# Altium schematic sheet RX_USBC.SchDoc
size 431 x 279 mm; Organization: ORGANIZATION; Address1: ADDRESS 1; Address2: ADDRESS 2; Address3: ADDRESS 3; Address4: ADDRESS 4; Revision: -; SheetNumber: 1; SheetTotal: 7; ENG_APP_DATE: --/--/--; DSN_APP_DATE: --/--/--; CHK_APP_DATE: --/--/--
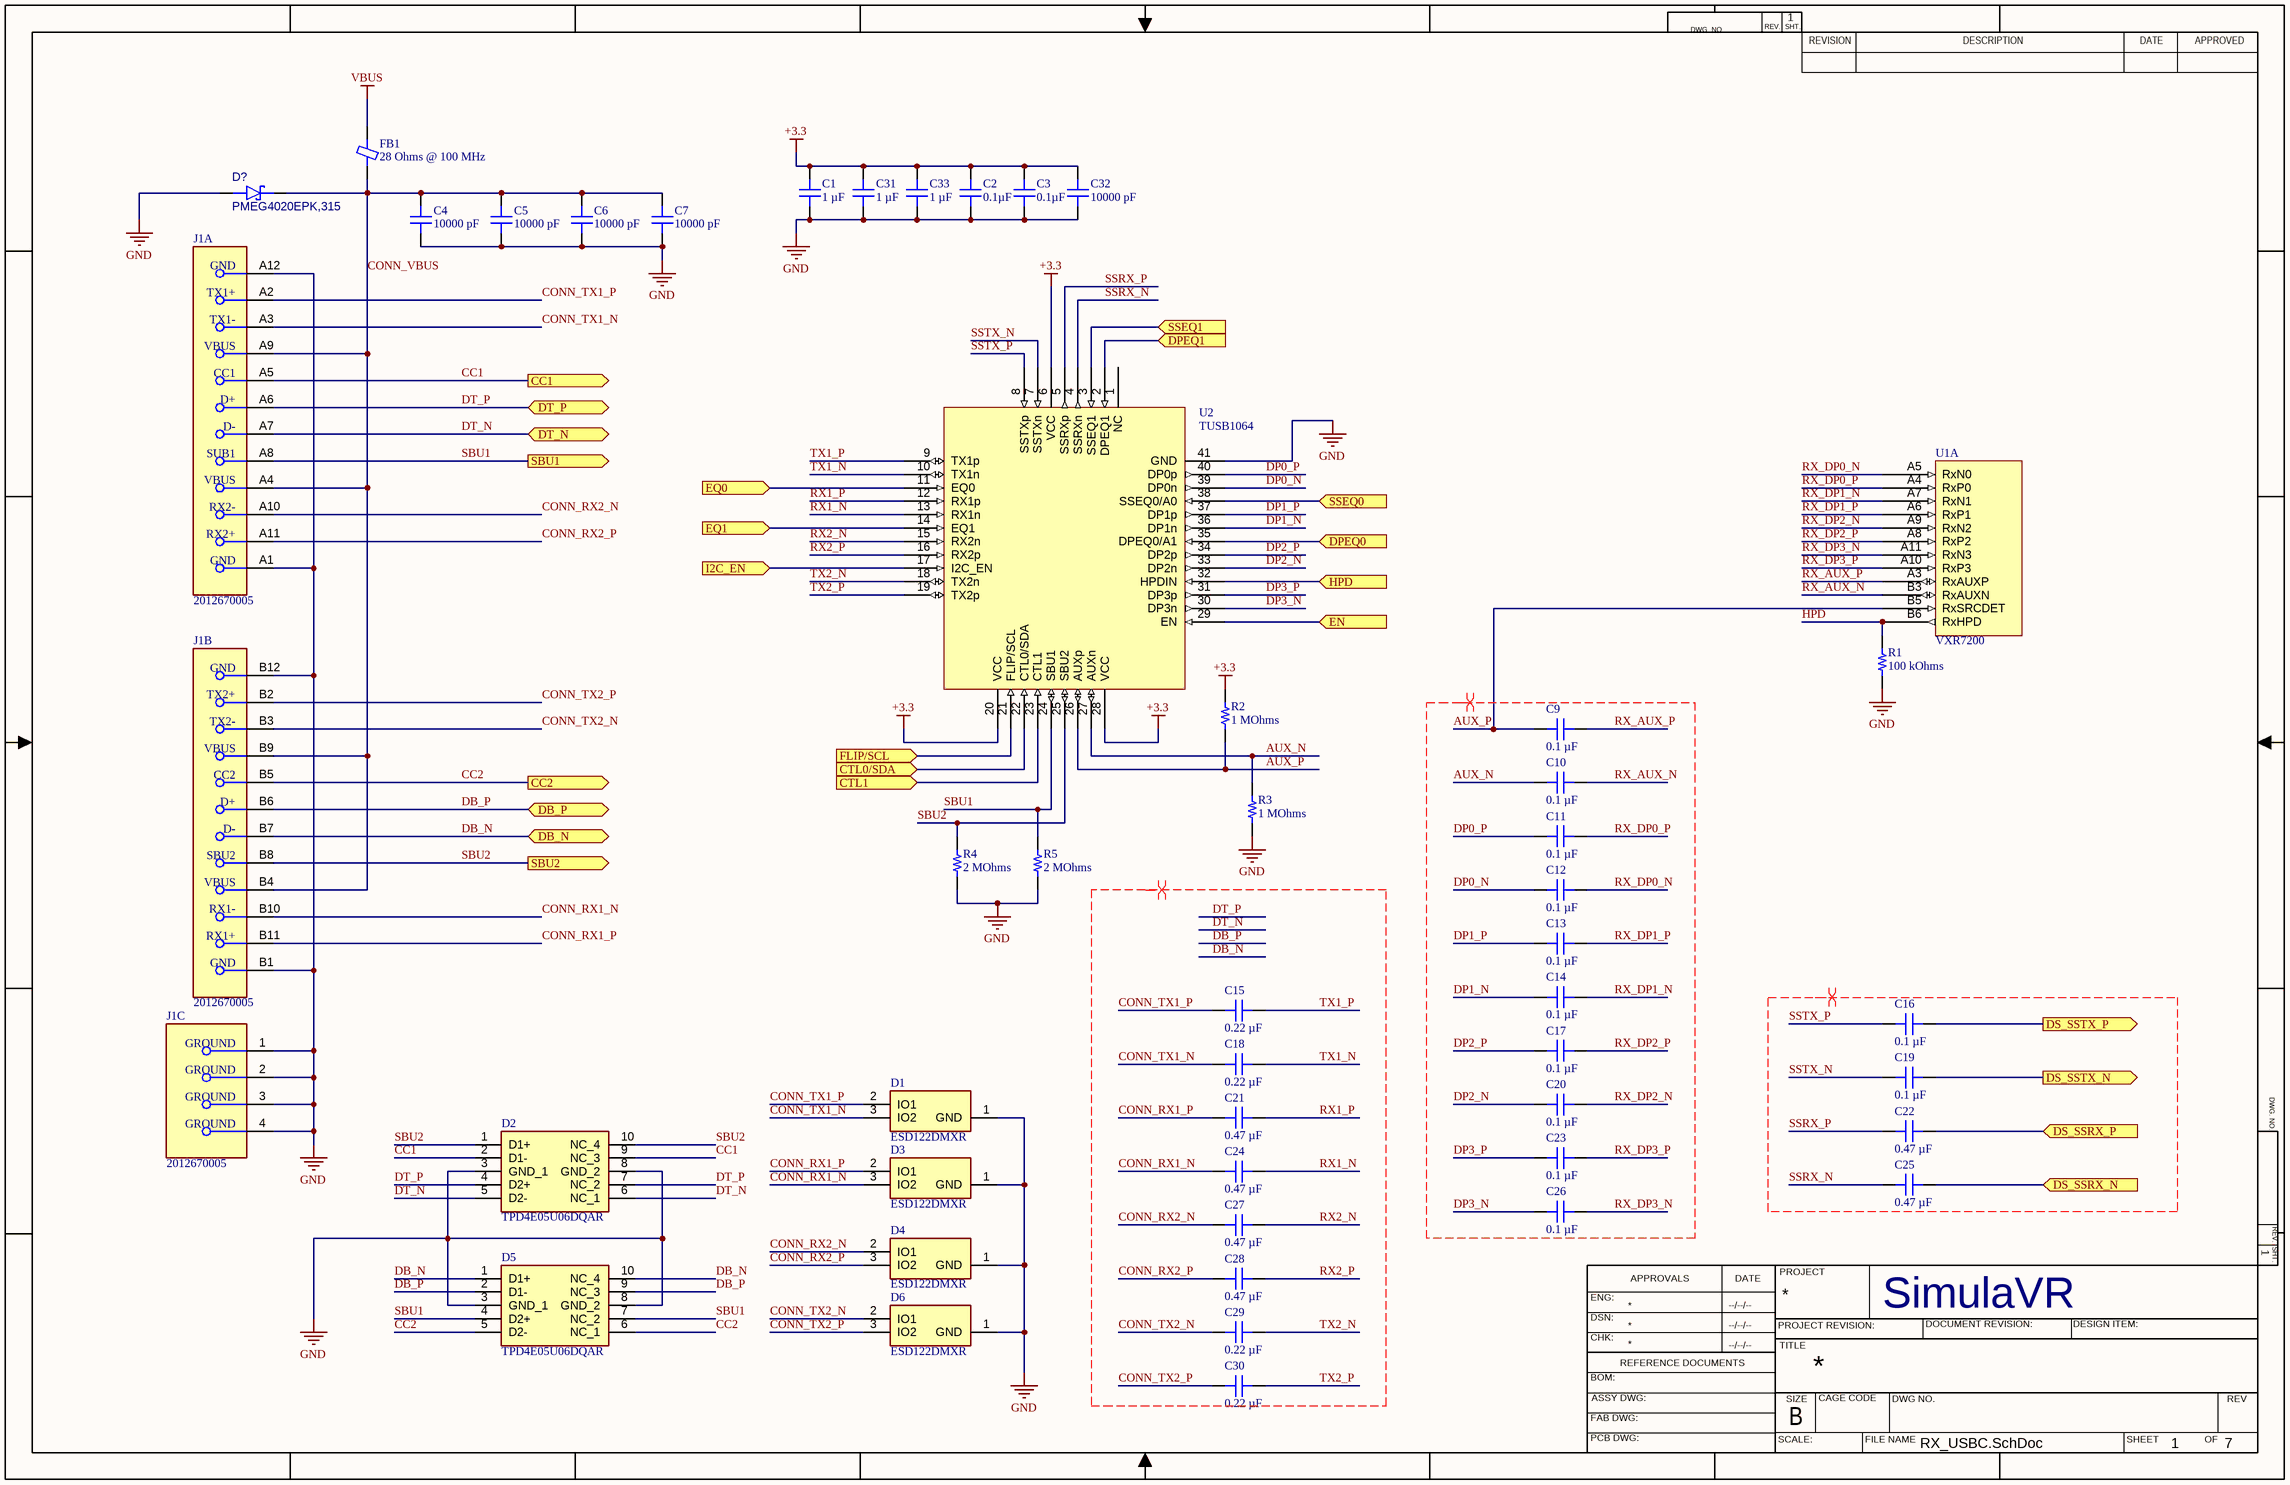
[diagram p0: RX_USBC.SchDoc]

## Parts
C1  1 µF  [CAP 0402_1005]
C2  0.1µF  [CAP 0402_1005]
C3  0.1µF  [CAP 0402_1005]
C4  10000 pF  [CAP 0402_1005]
C5  10000 pF  [CAP 0402_1005]
C6  10000 pF  [CAP 0402_1005]
C7  10000 pF  [CAP 0402_1005]
C9  0.1 µF  [CAP 0201_0603]
C10  0.1 µF  [CAP 0201_0603]
C11  0.1 µF  [CAP 0201_0603]
C12  0.1 µF  [CAP 0201_0603]
C13  0.1 µF  [CAP 0201_0603]
C14  0.1 µF  [CAP 0201_0603]
C15  0.22 µF  [CAP 0201_0603]
C16  0.1 µF  [CAP 0201_0603]
C17  0.1 µF  [CAP 0201_0603]
C18  0.22 µF  [CAP 0201_0603]
C19  0.1 µF  [CAP 0201_0603]
C20  0.1 µF  [CAP 0201_0603]
C21  0.47 µF  [CAP 0201_0603]
C22  0.47 µF  [CAP 0201_0603]
C23  0.1 µF  [CAP 0201_0603]
C24  0.47 µF  [CAP 0201_0603]
C25  0.47 µF  [CAP 0201_0603]
C26  0.1 µF  [CAP 0201_0603]
C27  0.47 µF  [CAP 0201_0603]
C28  0.47 µF  [CAP 0201_0603]
C29  0.22 µF  [CAP 0201_0603]
C30  0.22 µF  [CAP 0201_0603]
C31  1 µF  [CAP 0402_1005]
C32  10000 pF  [CAP 0402_1005]
C33  1 µF  [CAP 0402_1005]
D1  ESD122DMXR  [DMX0003A]
D2  TPD4E05U06DQAR  [DQA(R-PUSON-N10)]
D3  ESD122DMXR  [DMX0003A]
D4  ESD122DMXR  [DMX0003A]
D5  TPD4E05U06DQAR  [DQA(R-PUSON-N10)]
D6  ESD122DMXR  [DMX0003A]
D?  PMEG4020EPK,315  [DFN100P160X40-2N]
FB1  28 Ohms @ 100 MHz  [FER 0603_1608]
J1  2012670005  [FP-2012670005-MFG]  (parts A,B,C of 3)
R1  100 kOhms  [RES 0402_1005]
R2  1 MOhms  [RES 0402_1005]
R3  1 MOhms  [RES 0402_1005]
R4  2 MOhms  [RES 0402_1005]
R5  2 MOhms  [RES 0402_1005]
U1  VXR7200  [BGA121C50P11X11_600X600X90]  (part A of 9)
U2  TUSB1064  [QFN40P600X400X80_HS-41N]

## Ports
CC1 (out), CC2 (out), CTL0/SDA (in), CTL1 (in), DB_N (bidir), DB_P (bidir), DPEQ0 (in), DPEQ1 (in), DS_SSRX_N (in), DS_SSRX_P (in), DS_SSTX_N (out), DS_SSTX_P (out), DT_N (bidir), DT_P (bidir), EN (in), EQ0 (in), EQ1 (in), FLIP/SCL (in), HPD (in), I2C_EN (in), SBU1 (out), SBU2 (out), SSEQ0 (in), SSEQ1 (in)

## Nets
+3.3: C1.2 C2.2 C3.2 C31.2 C32.2 C33.2 R2.2 U2.6(VCC) U2.20(VCC) U2.28(VCC)
GND: C1.1 C2.1 C3.1 C4.1 C5.1 C6.1 C7.1 C31.1 C32.1 C33.1 D1.1(GND) D2.3(GND_1) D2.8(GND_2) D3.1(GND) D4.1(GND) D5.3(GND_1) D5.8(GND_2) D6.1(GND) D?.2(A) J1.1(GROUND) J1.2(GROUND) J1.3(GROUND) J1.4(GROUND) J1.A1(GND) J1.A12(GND) J1.B1(GND) J1.B12(GND) R1.1 R3.1 R4.1 R5.1 U2.41(GND)
VBUS: FB1.2
AUX_N: C10.1 R3.2 U2.27(AUXn)
AUX_P: C9.1 R2.1 U1.B5(RxSRCDET) U2.26(AUXp)
CC1: D2.2(D1-) D2.9(NC_3) J1.A5(CC1) ; port CC1
CC2: D5.5(D2-) D5.6(NC_1) J1.B5(CC2) ; port CC2
CONN_RX1_N: C24.1 D3.3(IO2) J1.B10(RX1-)
CONN_RX1_P: C21.1 D3.2(IO1) J1.B11(RX1+)
CONN_RX2_N: C27.1 D4.2(IO1) J1.A10(RX2-)
CONN_RX2_P: C28.1 D4.3(IO2) J1.A11(RX2+)
CONN_TX1_N: C18.1 D1.3(IO2) J1.A3(TX1-)
CONN_TX1_P: C15.1 D1.2(IO1) J1.A2(TX1+)
CONN_TX2_N: C29.1 D6.2(IO1) J1.B3(TX2-)
CONN_TX2_P: C30.1 D6.3(IO2) J1.B2(TX2+)
CONN_VBUS: C4.2 C5.2 C6.2 C7.2 D?.1(K) FB1.1 J1.A4(VBUS) J1.A9(VBUS) J1.B4(VBUS) J1.B9(VBUS)
CTL0/SDA: U2.22(CTL0/SDA) ; port CTL0/SDA
CTL1: U2.23(CTL1) ; port CTL1
DB_N: D5.1(D1+) D5.10(NC_4) J1.B7(D-) ; port DB_N
DB_P: D5.2(D1-) D5.9(NC_3) J1.B6(D+) ; port DB_P
DP0_N: C12.1 U2.39(DP0n)
DP0_P: C11.1 U2.40(DP0p)
DP1_N: C14.1 U2.36(DP1n)
DP1_P: C13.1 U2.37(DP1p)
DP2_N: C20.1 U2.33(DP2n)
DP2_P: C17.1 U2.34(DP2p)
DP3_N: C26.1 U2.30(DP3n)
DP3_P: C23.1 U2.31(DP3p)
DPEQ0: U2.35(DPEQ0/A1) ; port DPEQ0
DPEQ1: U2.2(DPEQ1) ; port DPEQ1
DS_SSRX_N: C25.2 ; port DS_SSRX_N
DS_SSRX_P: C22.2 ; port DS_SSRX_P
DS_SSTX_N: C19.2 ; port DS_SSTX_N
DS_SSTX_P: C16.2 ; port DS_SSTX_P
DT_N: D2.5(D2-) D2.6(NC_1) J1.A7(D-) ; port DT_N
DT_P: D2.4(D2+) D2.7(NC_2) J1.A6(D+) ; port DT_P
EN: U2.29(EN) ; port EN
EQ0: U2.11(EQ0) ; port EQ0
EQ1: U2.14(EQ1) ; port EQ1
FLIP/SCL: U2.21(FLIP/SCL) ; port FLIP/SCL
HPD: R1.2 U1.B6(RxHPD)
HPD: U2.32(HPDIN) ; port HPD  [a separate net that carries the same name]
I2C_EN: U2.17(I2C_EN) ; port I2C_EN
RX1_N: C24.2 U2.13(RX1n)
RX1_P: C21.2 U2.12(RX1p)
RX2_N: C27.2 U2.15(RX2n)
RX2_P: C28.2 U2.16(RX2p)
RX_AUX_N: C10.2 U1.B3(RxAUXN)
RX_AUX_P: C9.2 U1.A3(RxAUXP)
RX_DP0_N: C12.2 U1.A5(RxN0)
RX_DP0_P: C11.2 U1.A4(RxP0)
RX_DP1_N: C14.2 U1.A7(RxN1)
RX_DP1_P: C13.2 U1.A6(RxP1)
RX_DP2_N: C20.2 U1.A9(RxN2)
RX_DP2_P: C17.2 U1.A8(RxP2)
RX_DP3_N: C26.2 U1.A11(RxN3)
RX_DP3_P: C23.2 U1.A10(RxP3)
SBU1: D5.4(D2+) D5.7(NC_2) J1.A8(SUB1) R5.2 U2.24(SBU1) ; port SBU1
SBU2: D2.1(D1+) D2.10(NC_4) J1.B8(SBU2) R4.2 U2.25(SBU2) ; port SBU2
SSEQ0: U2.38(SSEQ0/A0) ; port SSEQ0
SSEQ1: U2.3(SSEQ1) ; port SSEQ1
SSRX_N: C25.1 U2.4(SSRXn)
SSRX_P: C22.1 U2.5(SSRXp)
SSTX_N: C19.1 U2.7(SSTXn)
SSTX_P: C16.1 U2.8(SSTXp)
TX1_N: C18.2 U2.10(TX1n)
TX1_P: C15.2 U2.9(TX1p)
TX2_N: C29.2 U2.18(TX2n)
TX2_P: C30.2 U2.19(TX2p)

Not connected (* = marked no-connect by the designer): U2 1(NC)

## Layout directives
differential pair; net class USB_SS; differential pair class USB_SS: CONN_RX1_N, CONN_RX1_P, CONN_RX2_N, CONN_RX2_P, CONN_TX1_N, CONN_TX1_P, CONN_TX2_N, CONN_TX2_P, DB_N, DB_P, DT_N, DT_P, RX1_N, RX1_P, RX2_N, RX2_P, SSRX_N, SSRX_P, SSTX_N, SSTX_P, TX1_N, TX1_P, TX2_N, TX2_P
differential pair; net class DP; differential pair class DP: AUX_N, AUX_P, DP0_N, DP0_P, DP1_N, DP1_P, DP2_N, DP2_P, DP3_N, DP3_P, RX_AUX_N, RX_AUX_P, RX_DP0_N, RX_DP0_P, RX_DP1_N, RX_DP1_P, RX_DP2_N, RX_DP2_P, RX_DP3_N, RX_DP3_P

## Notes on the sheet
- DWG. NO.
- REV.
- SHT.
- REVISION
- DESCRIPTION
- DATE
- APPROVED
- ENG:
- APPROVALS
- PROJECT
- DSN:
- CHK:
- REFERENCE DOCUMENTS
- PROJECT REVISION:
- TITLE
- SimulaVR
- DOCUMENT REVISION:
- DESIGN ITEM:
- BOM:
- FAB DWG:
- PCB DWG:
- ASSY DWG:
- SCALE:
- SIZE
- B
- CAGE CODE
- FILE NAME
- DWG NO.
- SHEET
- OF
- REV

## Library data of the parts
C1 C31 C33 = 885012105012: CAP CER 1UF 10V X5R 0402; manufacturer: Würth Elektronik; Tolerance: ±20%; Part Number: 885012105012; Value: 1 µF; Applications: General Purpose; Capacitance: 1 µF; componentlink1description: Datasheet; componentlink1url: https://katalog.we-online.de/pbs/datasheet/885012105012.pdf; componentlink2description: DigiKey Link; componentlink2url: https://www.digikey.com/en/products/detail/würth-elektronik/885012105012/5453344; Device Package: 0402 (1005 Metric); lastupdated: 3/4/2022 5:25:34 PM; Lifecycle Status: Active; Minimum Order: 1; Mounting Type: Surface Mount, MLCC; Operating Temperature: -55°C ~ 85°C; Package / Case: 0402 (1005 Metric); packaging: TapeAndReel; partid: 1807; Part Status: Active; price: 0.16; series: WCAP-CSGP; Size / Dimension: 0.039" L x 0.020" W (1.00mm x 0.50mm); Supplier 1: DigiKey; Supplier Part Number 1: 732-7489-1-ND; Temperature Coefficient: X5R; Thickness (Max): 0.022" (0.55mm); Voltage - Rated: 10V
C2 C3 = 0402ZC104KAT2A: CAP CER 0.1UF 10V X7R 0402; manufacturer: AVX Corporation; Tolerance: ±10%; Part Number: 0402ZC104KAT2A; Value: 0.1µF; Applications: General Purpose; Capacitance: 0.1µF; componentlink1description: Datasheet; componentlink1url: http://datasheets.avx.com/X7RDielectric.pdf; componentlink2description: DigiKey Link; componentlink2url: http://digikey.com/product-detail/en/avx-corporation/0402ZC104KAT2A/478-7891-1-ND/3881514; Device Package: 0402 (1005 Metric); lastupdated: 2/8/2022 12:26:59 PM; Lifecycle Status: Active; Minimum Order: 1; Mounting Type: Surface Mount, MLCC; Operating Temperature: -55°C ~ 125°C; Package / Case: 0402 (1005 Metric); packaging: TapeAndReel; partid: 1757; Part Status: Active; price: 0.09; series: -; Size / Dimension: 0.039" L x 0.020" W (1.00mm x 0.50mm); Supplier 1: DigiKey; Supplier Part Number 1: 478-7891-1-ND; Temperature Coefficient: X7R; Thickness (Max): 0.022" (0.55mm); Voltage - Rated: 10V
C4-C7 C32 = UMK105B7103MV-F: CAP CER 10000PF 50V X7R 0402; manufacturer: Taiyo Yuden; Tolerance: ±20%; Part Number: UMK105B7103MV-F; Value: 10000 pF; Applications: SMPS Filtering; Capacitance: 10000 pF; componentlink1description: Datasheet; componentlink1url: https://ds.yuden.co.jp/TYCOMPAS/ut/detail?pn=UMK105B7103MV-F &u=M; componentlink2description: DigiKey Link; componentlink2url: https://www.digikey.com/en/products/detail/taiyo-yuden/UMK105B7103MV-F/7403887; Device Package: 0402 (1005 Metric); lastupdated: 3/4/2022 5:25:33 PM; Lifecycle Status: Active; Minimum Order: 1; Mounting Type: Surface Mount, MLCC; Operating Temperature: -55°C ~ 125°C; Package / Case: 0402 (1005 Metric); packaging: CutTape; partid: 1897; Part Status: Active; price: 0.01; series: M; Size / Dimension: 0.039" L x 0.020" W (1.00mm x 0.50mm); Supplier 1: DigiKey; Supplier Part Number 1: 587-6364-1-ND; Temperature Coefficient: X7R; Thickness (Max): 0.026" (0.65mm); Voltage - Rated: 50V
C9-C14 C16 C17 C19 C20 C23 C26 = GRT033R60J104KE01D: CAP CER 0.1UF 6.3V X5R 0201; manufacturer: Murata Electronics; Tolerance: ±10%; Part Number: GRT033R60J104KE01D; Value: 0.1 µF; Applications: Automotive; Capacitance: 0.1 µF; componentlink1description: Datasheet; componentlink1url: https://search.murata.co.jp/Ceramy/image/img/A01X/G101/ENG/GRT033R60J104KE01-01.pdf; componentlink2description: DigiKey Link; componentlink2url: https://www.digikey.com/en/products/detail/murata-electronics/GRT033R60J104KE01D/7363050; Device Package: 0201 (0603 Metric); lastupdated: 3/4/2022 5:22:49 PM; Lifecycle Status: Active; Minimum Order: 1; Mounting Type: Surface Mount, MLCC; Operating Temperature: -55°C ~ 85°C; Package / Case: 0201 (0603 Metric); packaging: TapeAndReel; partid: 87; Part Status: Active; price: 0.01; Ratings: AEC-Q200; series: GRT; Size / Dimension: 0.024" L x 0.012" W (0.60mm x 0.30mm); Supplier 1: DigiKey; Supplier Part Number 1: 490-16306-1-ND; Temperature Coefficient: X5R; Thickness (Max): 0.013" (0.33mm); Voltage - Rated: 6.3V
C15 C18 C29 C30 = CL03A224KQ3NNNC: CAP CER 0.22UF 6.3V X5R 0201; manufacturer: Samsung Electro-Mechanics; Tolerance: ±10%; Part Number: CL03A224KQ3NNNC; Value: 0.22 µF; Applications: General Purpose; Capacitance: 0.22 µF; componentlink1description: Datasheet; componentlink1url: http://www.samsungsem.com/kr/support/product-search/mlcc/CL03A224KQ3NNNC.jsp; componentlink2description: DigiKey Link; componentlink2url: https://www.digikey.com/en/products/detail/samsung-electro-mechanics/CL03A224KQ3NNNC/3886990; Device Package: 0201 (0603 Metric); lastupdated: 3/4/2022 5:22:49 PM; Lifecycle Status: Active; Minimum Order: 1; Mounting Type: Surface Mount, MLCC; Operating Temperature: -55°C ~ 85°C; Package / Case: 0201 (0603 Metric); packaging: TapeAndReel; partid: 100; Part Status: Active; price: 0.01; series: CL; Size / Dimension: 0.024" L x 0.012" W (0.60mm x 0.30mm); Supplier 1: DigiKey; Supplier Part Number 1: 1276-1332-1-ND; Temperature Coefficient: X5R; Thickness (Max): 0.013" (0.33mm); Voltage - Rated: 6.3V
C21 C22 C24 C25 C27 C28 = GRM033R60J474ME90D: CAP CER 0.47UF 6.3V X5R 0201; manufacturer: Murata Electronics; Tolerance: ±20%; Part Number: GRM033R60J474ME90D; Value: 0.47 µF; Applications: General Purpose; Capacitance: 0.47 µF; componentlink1description: Datasheet; componentlink1url: https://search.murata.co.jp/Ceramy/image/img/A01X/G101/ENG/GRM033R60J474ME90-01.pdf; componentlink2description: DigiKey Link; componentlink2url: https://www.digikey.com/en/products/detail/murata-electronics/GRM033R60J474ME90D/5027495; Device Package: 0201 (0603 Metric); lastupdated: 3/4/2022 5:22:44 PM; Lifecycle Status: Active; Minimum Order: 1; Mounting Type: Surface Mount, MLCC; Operating Temperature: -55°C ~ 85°C; Package / Case: 0201 (0603 Metric); packaging: TapeAndReel; partid: 705; Part Status: Active; price: 0.01; series: GRM; Size / Dimension: 0.024" L x 0.012" W (0.60mm x 0.30mm); Supplier 1: DigiKey; Supplier Part Number 1: 490-10410-1-ND; Temperature Coefficient: X5R; Thickness (Max): 0.013" (0.33mm); Voltage - Rated: 6.3V
D1 D3 D4 D6 = ESD122DMXR: TVS Diode (Bi-directional); Manufacturer_Name: Texas Instruments; Datasheet Link: http://www.ti.com/lit/gpn/esd122; Manufacturer_Part_Number: ESD122DMXR; Mouser Part Number: 595-ESD122DMXR; Mouser Price/Stock: https://www.mouser.co.uk/ProductDetail/Texas-Instruments/ESD122DMXR?qs=gt1LBUVyoHlO%2FS8I%252Bb9aFA%3D%3D; Arrow Part Number: ESD122DMXR; Arrow Price/Stock: https://www.arrow.com/en/products/esd122dmxr/texas-instruments?region=nac
D2 D5 = TPD4E05U06DQAR: Diode; Manufacturer_Name: Texas Instruments; Datasheet Link: http://www.ti.com/lit/gpn/tpd4e05u06; Manufacturer_Part_Number: TPD4E05U06DQAR; Mouser Part Number: 595-TPD4E05U06DQAR; Mouser Price/Stock: https://www.mouser.co.uk/ProductDetail/Texas-Instruments/TPD4E05U06DQAR?qs=%2FCrDlo5IrVPi4woOvWz0qA%3D%3D; Arrow Part Number: TPD4E05U06DQAR; Arrow Price/Stock: https://www.arrow.com/en/products/tpd4e05u06dqar/texas-instruments?region=nac
D? = CMP-015-00010-1: Diode Schottky 40V 2A Surface Mount DFN1608D-2
FB1 = 742792603: FERRITE BEAD 28 OHM 0603 1LN; Manufacturer: Würth Elektronik; Current Rating (Max): 4A; DC Resistance (DCR) (Max): 30mOhm; Filter Type: Signal Line; Number of Lines: 1; Part Number: 742792603; ComponentLink1Description: Datasheet; ComponentLink1URL: https://katalog.we-online.de/pbs/datasheet/742792603.pdf; ComponentLink2Description: DigiKey Link; ComponentLink2URL: https://www.digikey.com/en/products/detail/würth-elektronik/742792603/1638994; Device Package: 0603 (1608 Metric); Height (Max): 0.039" (1.00mm); Impedance @ Frequency: 28 Ohms @ 100 MHz; LastUpdated: 3/4/2022 6:05:31 PM; Lifecycle Status: Active; Minimum Order: 1; Mounting Type: Surface Mount; Operating Temperature: -55°C ~ 125°C; Package / Case: 0603 (1608 Metric); Packaging: TapeAndReel; PartId: 1093; Part Status: Active; Price: 0.10; Series: WE-CBF; Size / Dimension: 0.063" L x 0.032" W (1.60mm x 0.80mm); Supplier 1: DigiKey; Supplier Part Number 1: 732-1590-1-ND; Value: 28 Ohms @ 100 MHz
J1 = CMP-04767-000003-1: CONN RCP USB3.1 TYPEC 24P SMD RA; Manufacturer: Molex; Is Female: yes; Conn Orientation: Right Angle; Shielding: true; Number Of Contacts: 24; Pitch: 0.5mm; Current Rating: 0.25/1.25/5A; Voltage Rating: 30V; Temperature: -40°C to +105°C; ComponentLink2Description: Datasheet; Octopart: https://octopart.com/201267-0005-molex-77836528; Height: 3.86mm; Contact Material: Gold,Nickel; ComponentLink2URL: https://www.molex.com/webdocs/datasheets/pdf/en-us/2012670005_IO_CONNECTORS.pdf; Footprint Url: https://www.molex.com/pdm_docs/sd/2012670005_sd.pdf; Digikey Description: CONN RCP USB3.1 TYPEC 24P SMD RA; Temperature Range High: +105°C; Automotive: No; RoHS: TRUE; Manufacturer Part Number: 2012670005; Device Class L3: unset; Device Class L2: USB Connectors; Category: Conn; Lead Free: Yes; Usb Standard: USB 3.1; Device Class L1: Connectors; Temperature Range Low: -40°C; Package: 2012670005
R1 = AC0402JR-07100KL: RES SMD 100K OHM 5% 1/16W 0402; Manufacturer: Yageo; Power (Watts): 0.063W, 1/16W; Temperature Coefficient: ±100ppm/°C; Part Number: AC0402JR-07100KL; Value: 100 kOhms; ComponentLink1Description: Datasheet; ComponentLink1URL: https://www.yageo.com/upload/media/product/productsearch/datasheet/rchip/PYu-AC_51_RoHS_L_7.pdf; ComponentLink2Description: DigiKey Link; ComponentLink2URL: https://www.digikey.com/en/products/detail/yageo/AC0402JR-07100KL/5895569; Composition: Thick Film; Device Package: 0402 (1005 Metric); Features: Automotive AEC-Q200, Moisture Resistant; Height - Seated (Max): 0.015" (0.37mm); LastUpdated: 3/4/2022 5:41:14 PM; Lifecycle Status: Active; Minimum Order: 1; Number of Terminations: 2; Operating Temperature: -55°C ~ 155°C; Package / Case: 0402 (1005 Metric); Packaging: CutTape; PartId: 3380; Part Status: Active; Price: 0.01; Ratings: AEC-Q200; Resistance: 100 kOhms; Series: AC; Size / Dimension: 0.039" L x 0.020" W (1.00mm x 0.50mm); Supplier 1: DigiKey; Supplier Part Number 1: YAG3515CT-ND; Supplier Device Package: 0402; Tolerance: ±5%
R2 R3 = AC0402JR-071ML: RES SMD 1M OHM 5% 1/16W 0402; Manufacturer: Yageo; Power (Watts): 0.063W, 1/16W; Temperature Coefficient: ±100ppm/°C; Part Number: AC0402JR-071ML; Value: 1 MOhms; ComponentLink1Description: Datasheet; ComponentLink1URL: https://www.yageo.com/upload/media/product/productsearch/datasheet/rchip/PYu-AC_51_RoHS_L_7.pdf; ComponentLink2Description: DigiKey Link; ComponentLink2URL: https://www.digikey.com/en/products/detail/yageo/AC0402JR-071ML/5895610; Composition: Thick Film; Device Package: 0402 (1005 Metric); Features: Automotive AEC-Q200, Moisture Resistant; Height - Seated (Max): 0.015" (0.37mm); LastUpdated: 3/4/2022 5:41:14 PM; Lifecycle Status: Active; Minimum Order: 1; Number of Terminations: 2; Operating Temperature: -55°C ~ 155°C; Package / Case: 0402 (1005 Metric); Packaging: CutTape; PartId: 3387; Part Status: Active; Price: 0.01; Ratings: AEC-Q200; Resistance: 1 MOhms; Series: AC; Size / Dimension: 0.039" L x 0.020" W (1.00mm x 0.50mm); Supplier 1: DigiKey; Supplier Part Number 1: YAG3526CT-ND; Supplier Device Package: 0402; Tolerance: ±5%
R4 R5 = RMCF0402JT2M00: RES 2M OHM 5% 1/16W 0402; Manufacturer: Stackpole Electronics Inc; Power (Watts): 0.063W, 1/16W; Temperature Coefficient: ±200ppm/°C; Part Number: RMCF0402JT2M00; Value: 2 MOhms; ComponentLink1Description: Datasheet; ComponentLink1URL: https://www.seielect.com/catalog/sei-rmcf_rmcp.pdf; ComponentLink2Description: DigiKey Link; ComponentLink2URL: https://www.digikey.com/en/products/detail/stackpole-electronics-inc/RMCF0402JT2M00/1712425; Composition: Thick Film; Device Package: 0402 (1005 Metric); Features: Automotive AEC-Q200; Height - Seated (Max): 0.016" (0.40mm); LastUpdated: 3/4/2022 5:41:16 PM; Lifecycle Status: Active; Minimum Order: 1; Number of Terminations: 2; Operating Temperature: -55°C ~ 155°C; Package / Case: 0402 (1005 Metric); Packaging: CutTape; PartId: 2925; Part Status: Active; Price: 0.01; Ratings: AEC-Q200; Resistance: 2 MOhms; Series: RMCF; Size / Dimension: 0.039" L x 0.020" W (1.00mm x 0.50mm); Supplier 1: DigiKey; Supplier Part Number 1: 738-RMCF0402JT2M00CT-ND; Supplier Device Package: 0402; Tolerance: ±5%
U1 = CMP-015-00008-3: VXR7200 DP to MIPI-DSI bridge
U2 = CMP-015-00009-2